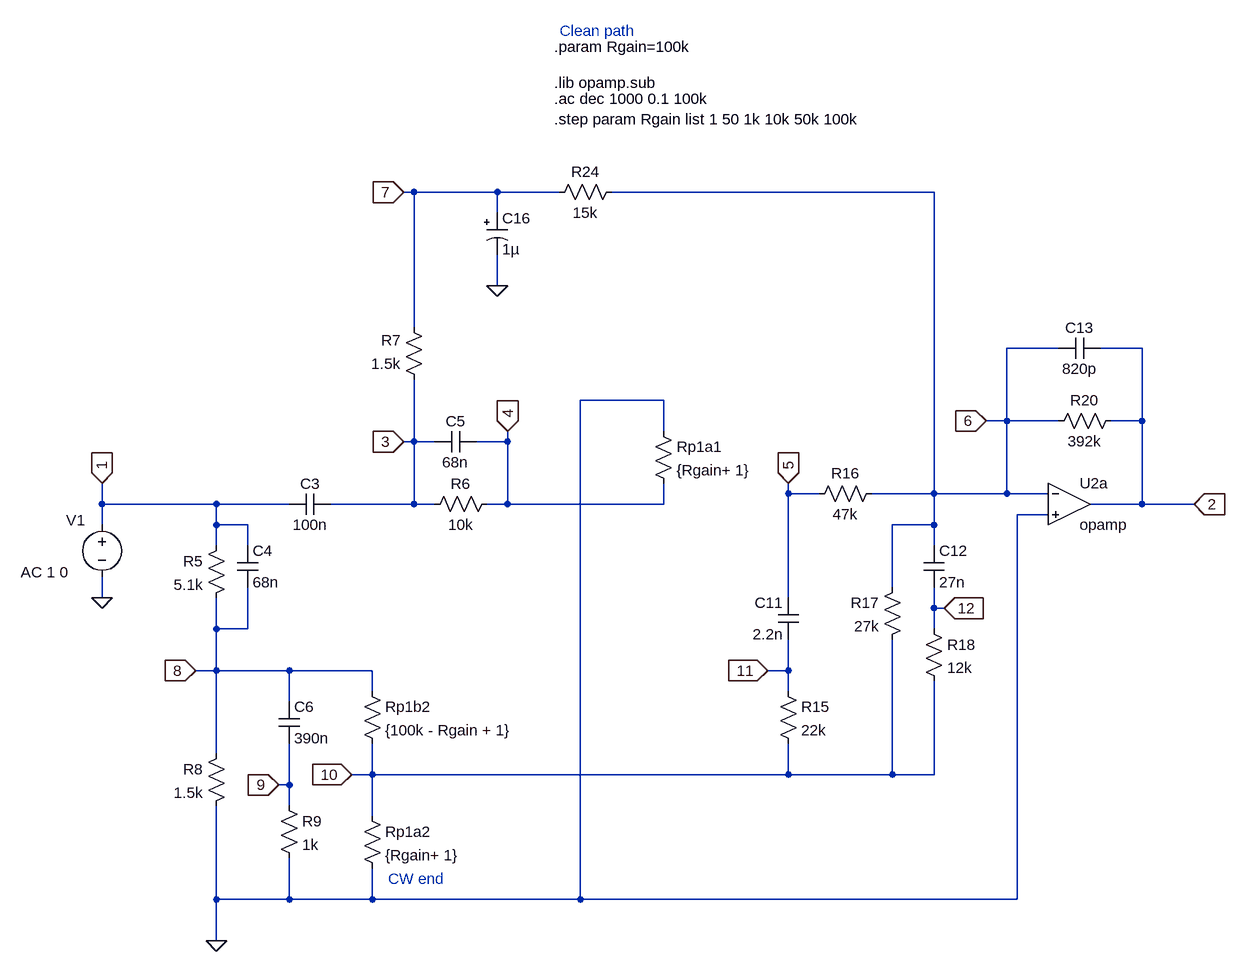
[diagram p0: schematic Klon-Centaur_sum_path_123_v1.asc]
Klon-Centaur_sum_path_123_v1.asc, the LTspice schematic file:
Version 4
SHEET 1 4496 5064
WIRE 96 2080 80 2080
WIRE 224 2080 96 2080
WIRE 320 2080 224 2080
WIRE 896 2080 400 2080
WIRE 224 2112 224 2080
WIRE 224 2224 224 2176
WIRE 96 2288 96 2080
WIRE 1088 2320 1008 2320
WIRE 1216 2320 1152 2320
WIRE 480 2400 352 2400
WIRE 1008 2432 1008 2320
WIRE 1008 2432 976 2432
WIRE 1088 2432 1008 2432
WIRE 1216 2432 1216 2320
WIRE 1216 2432 1168 2432
WIRE 480 2448 480 2400
WIRE 96 2464 96 2368
WIRE 96 2464 80 2464
WIRE 128 2464 96 2464
WIRE 240 2464 240 2448
WIRE 240 2464 192 2464
WIRE 672 2544 672 2528
WIRE 720 2544 672 2544
WIRE 896 2544 896 2080
WIRE 896 2544 800 2544
WIRE 1008 2544 1008 2432
WIRE 1008 2544 896 2544
WIRE 1072 2544 1008 2544
WIRE -384 2560 -384 2528
WIRE -208 2560 -384 2560
WIRE -96 2560 -208 2560
WIRE 96 2560 96 2464
WIRE 96 2560 -32 2560
WIRE 128 2560 96 2560
WIRE 240 2560 240 2464
WIRE 240 2560 208 2560
WIRE 480 2560 480 2528
WIRE 480 2560 240 2560
WIRE 1216 2560 1216 2432
WIRE 1216 2560 1136 2560
WIRE 1296 2560 1216 2560
WIRE 1072 2576 1024 2576
WIRE -384 2592 -384 2560
WIRE -208 2592 -208 2560
WIRE -160 2592 -208 2592
WIRE 896 2592 896 2544
WIRE 896 2592 832 2592
WIRE -208 2624 -208 2592
WIRE -160 2624 -160 2592
WIRE 896 2624 896 2592
WIRE 832 2688 832 2592
WIRE -384 2704 -384 2672
WIRE 672 2704 672 2544
WIRE 896 2720 896 2688
WIRE 912 2720 896 2720
WIRE -208 2752 -208 2704
WIRE -160 2752 -160 2688
WIRE -160 2752 -208 2752
WIRE 896 2752 896 2720
WIRE -208 2816 -208 2752
WIRE -208 2816 -240 2816
WIRE -96 2816 -208 2816
WIRE 32 2816 -96 2816
WIRE 672 2816 672 2768
WIRE 672 2816 640 2816
WIRE 32 2848 32 2816
WIRE 672 2848 672 2816
WIRE -96 2864 -96 2816
WIRE -208 2944 -208 2816
WIRE 32 2976 32 2928
WIRE 32 2976 0 2976
WIRE 672 2976 672 2928
WIRE 672 2976 32 2976
WIRE 832 2976 832 2768
WIRE 832 2976 672 2976
WIRE 896 2976 896 2832
WIRE 896 2976 832 2976
WIRE -96 2992 -96 2928
WIRE -96 2992 -112 2992
WIRE -96 3024 -96 2992
WIRE 32 3040 32 2976
WIRE -208 3168 -208 3024
WIRE -96 3168 -96 3104
WIRE -96 3168 -208 3168
WIRE 32 3168 32 3120
WIRE 32 3168 -96 3168
WIRE 352 3168 352 2400
WIRE 352 3168 32 3168
WIRE 1024 3168 1024 2576
WIRE 1024 3168 352 3168
WIRE -208 3232 -208 3168
FLAG -384 2528 1
IOPIN -384 2528 In
FLAG 224 2224 0
FLAG 1296 2560 2
IOPIN 1296 2560 In
FLAG -208 3232 0
FLAG -384 2704 0
FLAG 80 2464 3
IOPIN 80 2464 In
FLAG 80 2080 7
IOPIN 80 2080 In
FLAG 240 2448 4
IOPIN 240 2448 In
FLAG 672 2528 5
IOPIN 672 2528 In
FLAG 640 2816 11
IOPIN 640 2816 In
FLAG 912 2720 12
IOPIN 912 2720 In
FLAG 0 2976 10
IOPIN 0 2976 In
FLAG -112 2992 9
IOPIN -112 2992 In
FLAG -240 2816 8
IOPIN -240 2816 In
FLAG 976 2432 6
IOPIN 976 2432 In
SYMBOL voltage -384 2576 R0
WINDOW 0 -55 9 Left 2
WINDOW 123 -125 89 Left 2
WINDOW 39 0 0 Left 0
WINDOW 3 -289 58 Left 2
SYMATTR InstName V1
SYMATTR Value2 AC 1 0
SYMATTR Value ""
SYMBOL res -192 2608 M0
SYMATTR InstName R5
SYMATTR Value 5.1k
SYMBOL res -192 2928 M0
SYMATTR InstName R8
SYMATTR Value 1.5k
SYMBOL cap -32 2544 R90
WINDOW 0 0 32 VBottom 2
WINDOW 3 32 32 VTop 2
SYMATTR InstName C3
SYMATTR Value 100n
SYMBOL cap -176 2624 R0
SYMATTR InstName C4
SYMATTR Value 68n
SYMBOL cap -112 2864 R0
SYMATTR InstName C6
SYMATTR Value 390n
SYMBOL res -112 3008 R0
SYMATTR InstName R9
SYMATTR Value 1k
SYMBOL res 224 2544 R90
WINDOW 0 0 56 VBottom 2
WINDOW 3 32 56 VTop 2
SYMATTR InstName R6
SYMATTR Value 10k
SYMBOL cap 192 2448 R90
WINDOW 0 0 32 VBottom 2
WINDOW 3 32 32 VTop 2
SYMATTR InstName C5
SYMATTR Value 68n
SYMBOL res 16 2832 R0
SYMATTR InstName Rp1b2
SYMATTR Value {100k - Rgain + 1}
SYMBOL res 16 3024 R0
SYMATTR InstName Rp1a2
SYMATTR Value {Rgain+ 1}
SYMBOL res 464 2432 R0
SYMATTR InstName Rp1a1
SYMATTR Value {Rgain+ 1}
SYMBOL cap 688 2704 M0
SYMATTR InstName C11
SYMATTR Value 2.2n
SYMBOL res 656 2832 R0
SYMATTR InstName R15
SYMATTR Value 22k
SYMBOL res 848 2672 M0
SYMATTR InstName R17
SYMATTR Value 27k
SYMBOL res 880 2736 R0
SYMATTR InstName R18
SYMATTR Value 12k
SYMBOL cap 880 2624 R0
SYMATTR InstName C12
SYMATTR Value 27n
SYMBOL res 816 2528 R90
WINDOW 0 0 56 VBottom 2
WINDOW 3 32 56 VTop 2
SYMATTR InstName R16
SYMATTR Value 47k
SYMBOL res 112 2384 R180
WINDOW 0 36 76 Left 2
WINDOW 3 36 40 Left 2
SYMATTR InstName R7
SYMATTR Value 1.5k
SYMBOL res 416 2064 R90
WINDOW 0 0 56 VBottom 2
WINDOW 3 32 56 VTop 2
SYMATTR InstName R24
SYMATTR Value 15k
SYMBOL res 1184 2416 R90
WINDOW 0 0 56 VBottom 2
WINDOW 3 32 56 VTop 2
SYMATTR InstName R20
SYMATTR Value 392k
SYMBOL cap 1152 2304 R90
WINDOW 0 0 32 VBottom 2
WINDOW 3 32 32 VTop 2
SYMATTR InstName C13
SYMATTR Value 820p
SYMBOL OpAmps\\opamp 1104 2496 R0
SYMATTR InstName U2a
SYMBOL polcap 208 2112 R0
SYMATTR InstName C16
SYMATTR Value 1µ
TEXT 312 1856 Left 2 !.param Rgain=100k
TEXT 312 1912 Left 2 !.lib opamp.sub
TEXT 312 1936 Left 2 !.ac dec 1000 0.1 100k
TEXT 56 3136 Left 2 ;CW end
TEXT 312 1968 Left 2 !.step param Rgain list 1 50 1k 10k 50k 100k
TEXT 320 1832 Left 2 ;Clean path

The netlist it stands for:
* Klon-Centaur_sum_path_123_v1.asc
V1 1 0 AC 1 0
R5 1 8 5.1k
R8 8 0 1.5k
C3 3 1 100n
C4 1 8 68n
C6 8 9 390n
R9 9 0 1k
R6 4 3 10k
C5 4 3 68n
Rp1b2 8 10 {100k - Rgain + 1}
Rp1a2 10 0 {Rgain+ 1}
Rp1a1 0 4 {Rgain+ 1}
C11 5 11 2.2n
R15 11 10 22k
R17 6 10 27k
R18 12 10 12k
C12 6 12 27n
R16 6 5 47k
R7 3 7 1.5k
R24 6 7 15k
R20 2 6 392k
C13 2 6 820p
XU2a 6 0 2 opamp Aol=100K GBW=10Meg  ; pins invin noninvin out
C16 7 0 1µ
.param Rgain=100k
.lib opamp.sub
.ac dec 1000 0.1 100k
* CW end
.step param Rgain list 1 50 1k 10k 50k 100k
* Clean path
.backanno
.end